# EAGLE design ATEM-Tally-SDI (EAGLE 7.7.0)
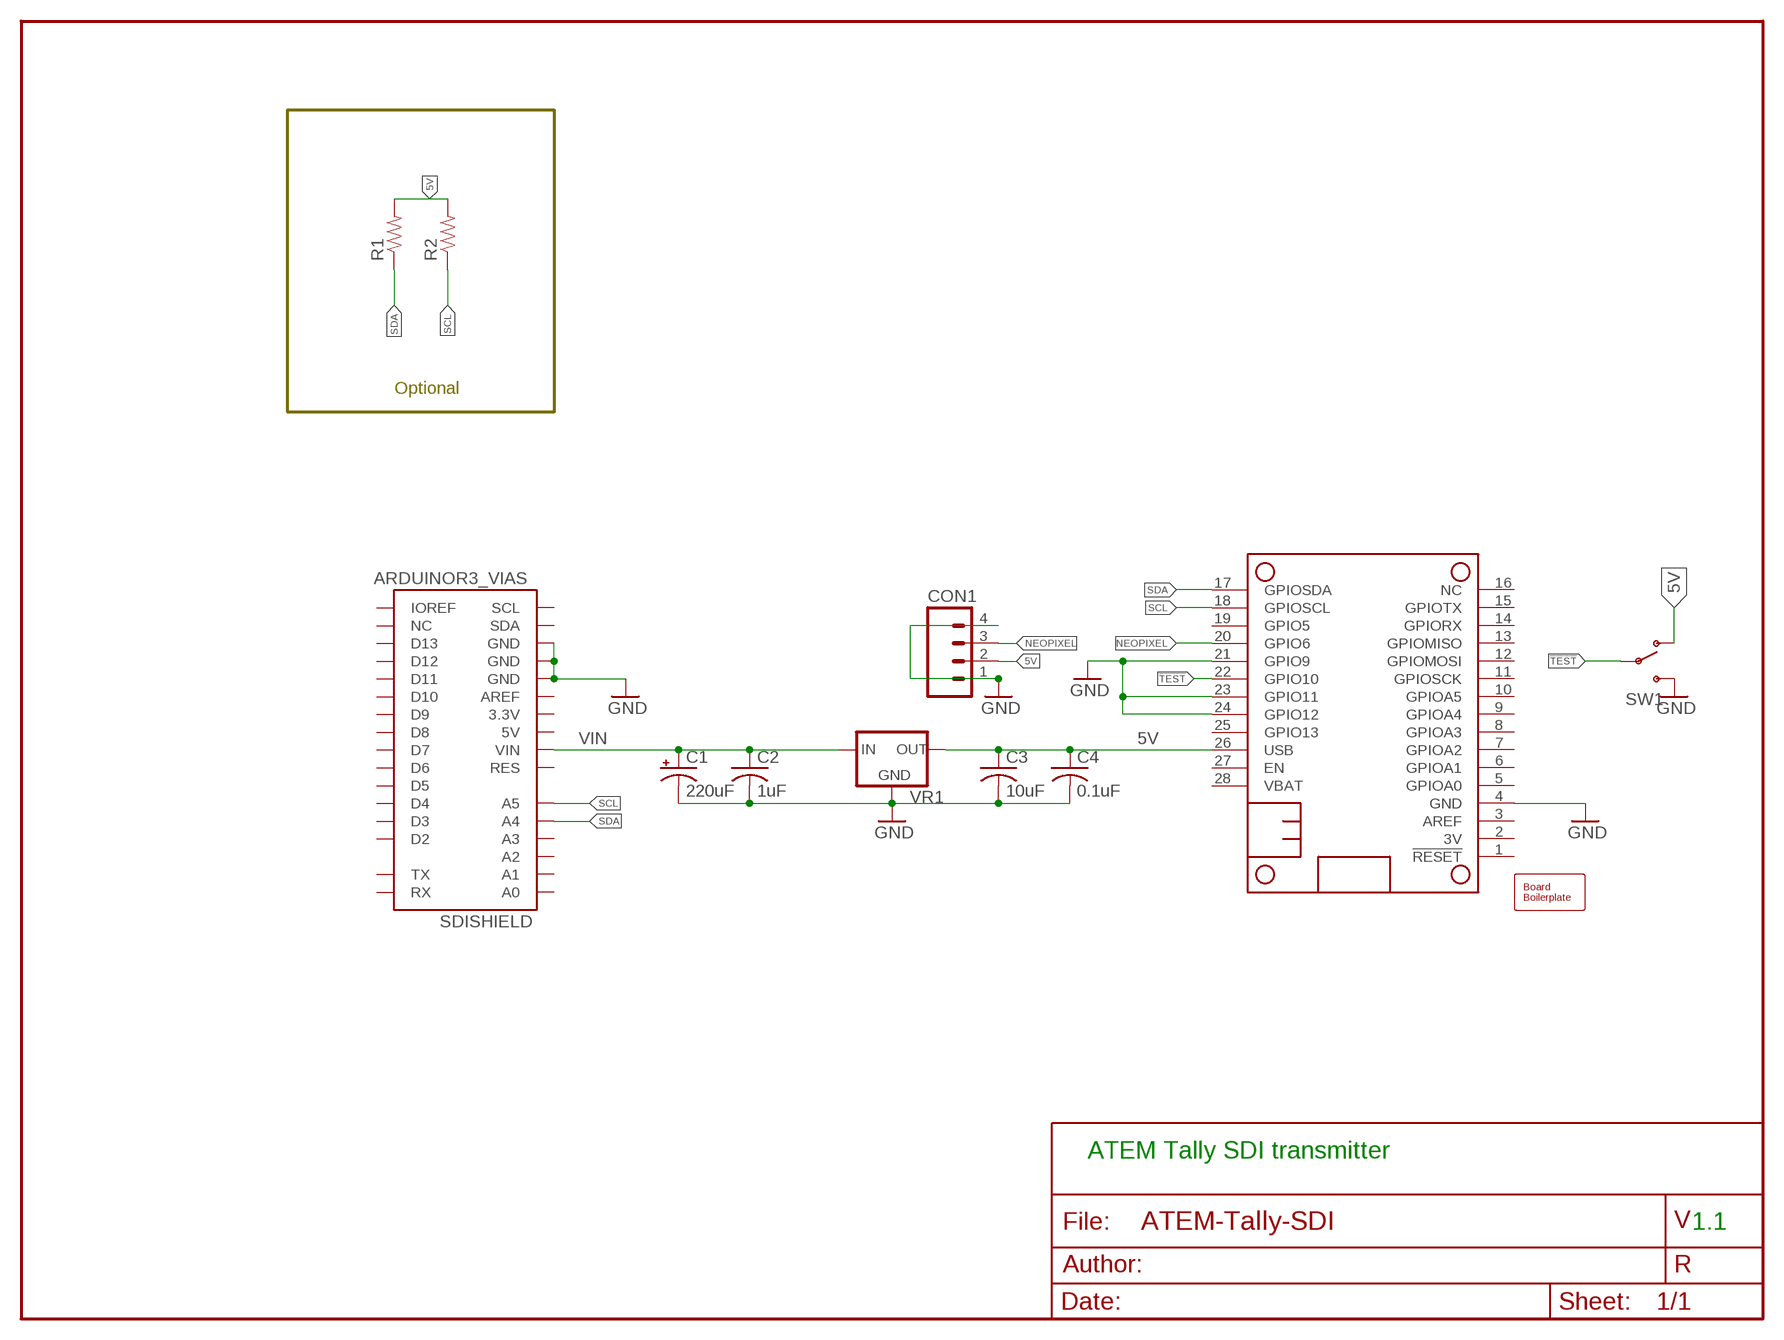
[diagram p0: schematic, sheet 1]

## Parts
BOARD1  BOARD80X100  [BOARD-DINRAIL-3.17INX10CM]
C1  220uF  CAP-POL0810  [0810-CAP]
C2  1uF  CAP0603  [0603-CAP]
C3  10uF  CAP0603  [0603-CAP]
C4  0.1uF  CAP0603  [0603-CAP]
CON1  CONNECTOR-M04LOCK  [1X04_LOCK]
FEATHER  FEATHERWING_NODIM  [FEATHERWING_DIM]
R1  RPTH04  [AXIAL-0.4-RES]
R2  RPTH04  [AXIAL-0.4-RES]
SDISHIELD  ARDUINOR3_VIAS  [ARDUINO_R3_VIAS]
SW1  SWITCH-SPSTPTH  [SWITCH-SPDT]
VR1  VREG-DPAK-5  [TO-252]

## Nets
5V: C3.1 C4.1 CON1.2 FEATHER.26(USB) R1.P$2 R2.P$2 SW1.1(O) VR1.3(OUT)
!TEST: FEATHER.22(GPIO10) SW1.2(P)
GND: C1.- C2.2 C3.2 C4.2 CON1.1 CON1.4 FEATHER.4(GND) FEATHER.21(GPIO9) FEATHER.23(GPIO11) FEATHER.24(GPIO12) SDISHIELD.GND@0(GND) SDISHIELD.GND@1(GND) SDISHIELD.GND@2(GND) SW1.3(S) VR1.2(GND)
NEOPIXEL: CON1.3 FEATHER.20(GPIO6)
SCL: FEATHER.18(GPIOSCL) R2.P$1 SDISHIELD.A5
SDA: FEATHER.17(GPIOSDA) R1.P$1 SDISHIELD.A4
VIN: C1.+ C2.1 SDISHIELD.VIN VR1.1(IN)
Unconnected: FEATHER.1(!RESET) FEATHER.2(3V) FEATHER.3(AREF) FEATHER.5(GPIOA0) FEATHER.6(GPIOA1) FEATHER.7(GPIOA2) FEATHER.8(GPIOA3) FEATHER.9(GPIOA4) FEATHER.10(GPIOA5) FEATHER.11(GPIOSCK) FEATHER.12(GPIOMOSI) FEATHER.13(GPIOMISO) FEATHER.14(GPIORX) FEATHER.15(GPIOTX) FEATHER.16(NC) FEATHER.19(GPIO5) FEATHER.25(GPIO13) FEATHER.27(EN) FEATHER.28(VBAT) SDISHIELD.3.3V SDISHIELD.5V SDISHIELD.A0 SDISHIELD.A1 SDISHIELD.A2 SDISHIELD.A3 SDISHIELD.AREF SDISHIELD.D2 SDISHIELD.D3 SDISHIELD.D4 SDISHIELD.D5 SDISHIELD.D6 SDISHIELD.D7 SDISHIELD.D8 SDISHIELD.D9 SDISHIELD.D10 SDISHIELD.D11 SDISHIELD.D12 SDISHIELD.D13 SDISHIELD.IOREF SDISHIELD.NC1(NC) SDISHIELD.RES SDISHIELD.RX SDISHIELD.SCL SDISHIELD.SDA SDISHIELD.TX

## Notes on the sheet
- Optional
- ATEM Tally SDI transmitter
- 1.1

## Library data of the parts
BOARD1 = SPCoast:BOARD
C1 = SPCoast:CAP-POL*
C2-C4 = SPCoast:CAP*
CON1 = SPCoast:CONNECTOR-M04: Header 4 Standard 4-pin 0.1" header. Use with straight break away headers (SKU : PRT-00116), right angle break away headers (PRT-00553), swiss pins (PRT-00743), machine pins (PRT-00117), and female headers (PRT-00115). Molex polarized connector foot print use with SKU : PRT-08231 with associated crimp pins and housings. 1MM SMD Version SKU: PRT-10208
FEATHER = adafruit:FEATHERWING
R1 R2 = SPCoast:R*: Resistor Basic schematic elements and footprints for 0603, 1206, and PTH 1/10th watt (small) resistors.
SDISHIELD = SPCoast:ARDUINO
SW1 = SPCoast:SWITCH-SPST: SPST Switch Simple slide switch. Spark Fun Electronics SKU : COM-00102
VR1 = SPCoast:VREG-?-*: Voltage Regulator Standard linear regulator. 7805 uses IGO pinout LM1117 uses GOI pinout

## Board
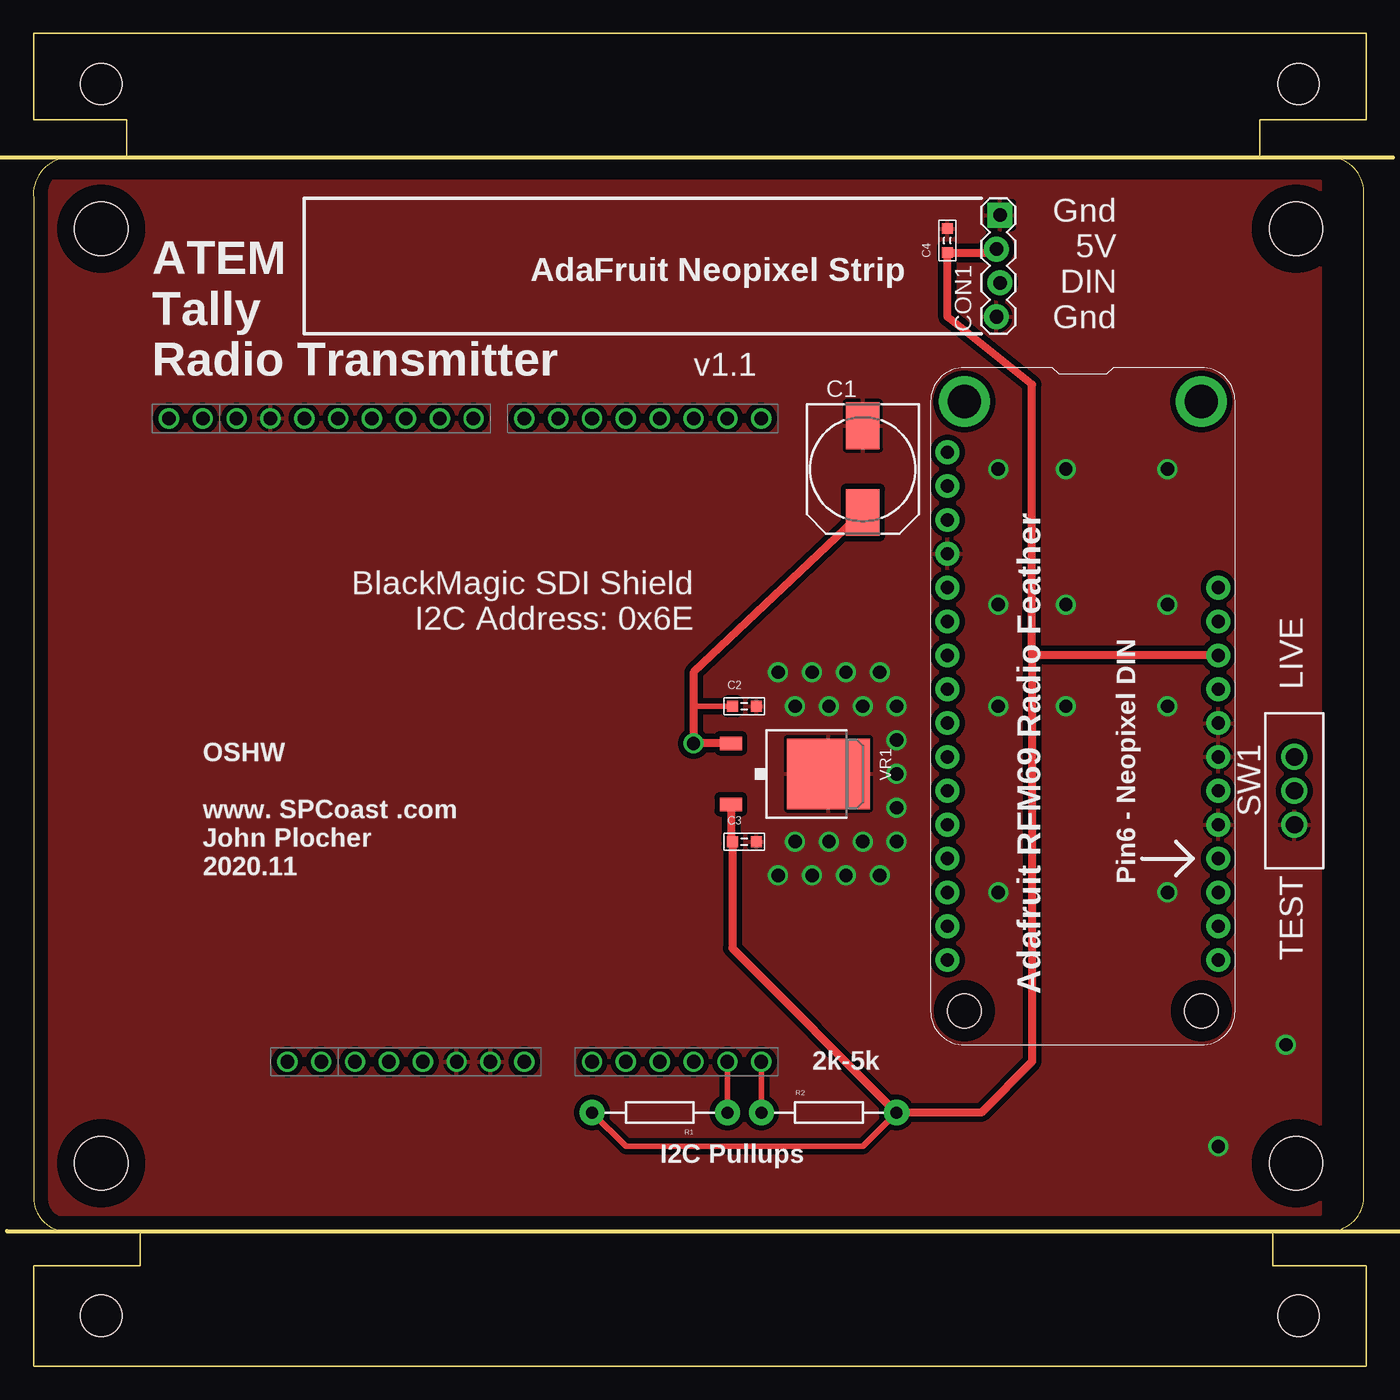
[diagram p1: board, top side]
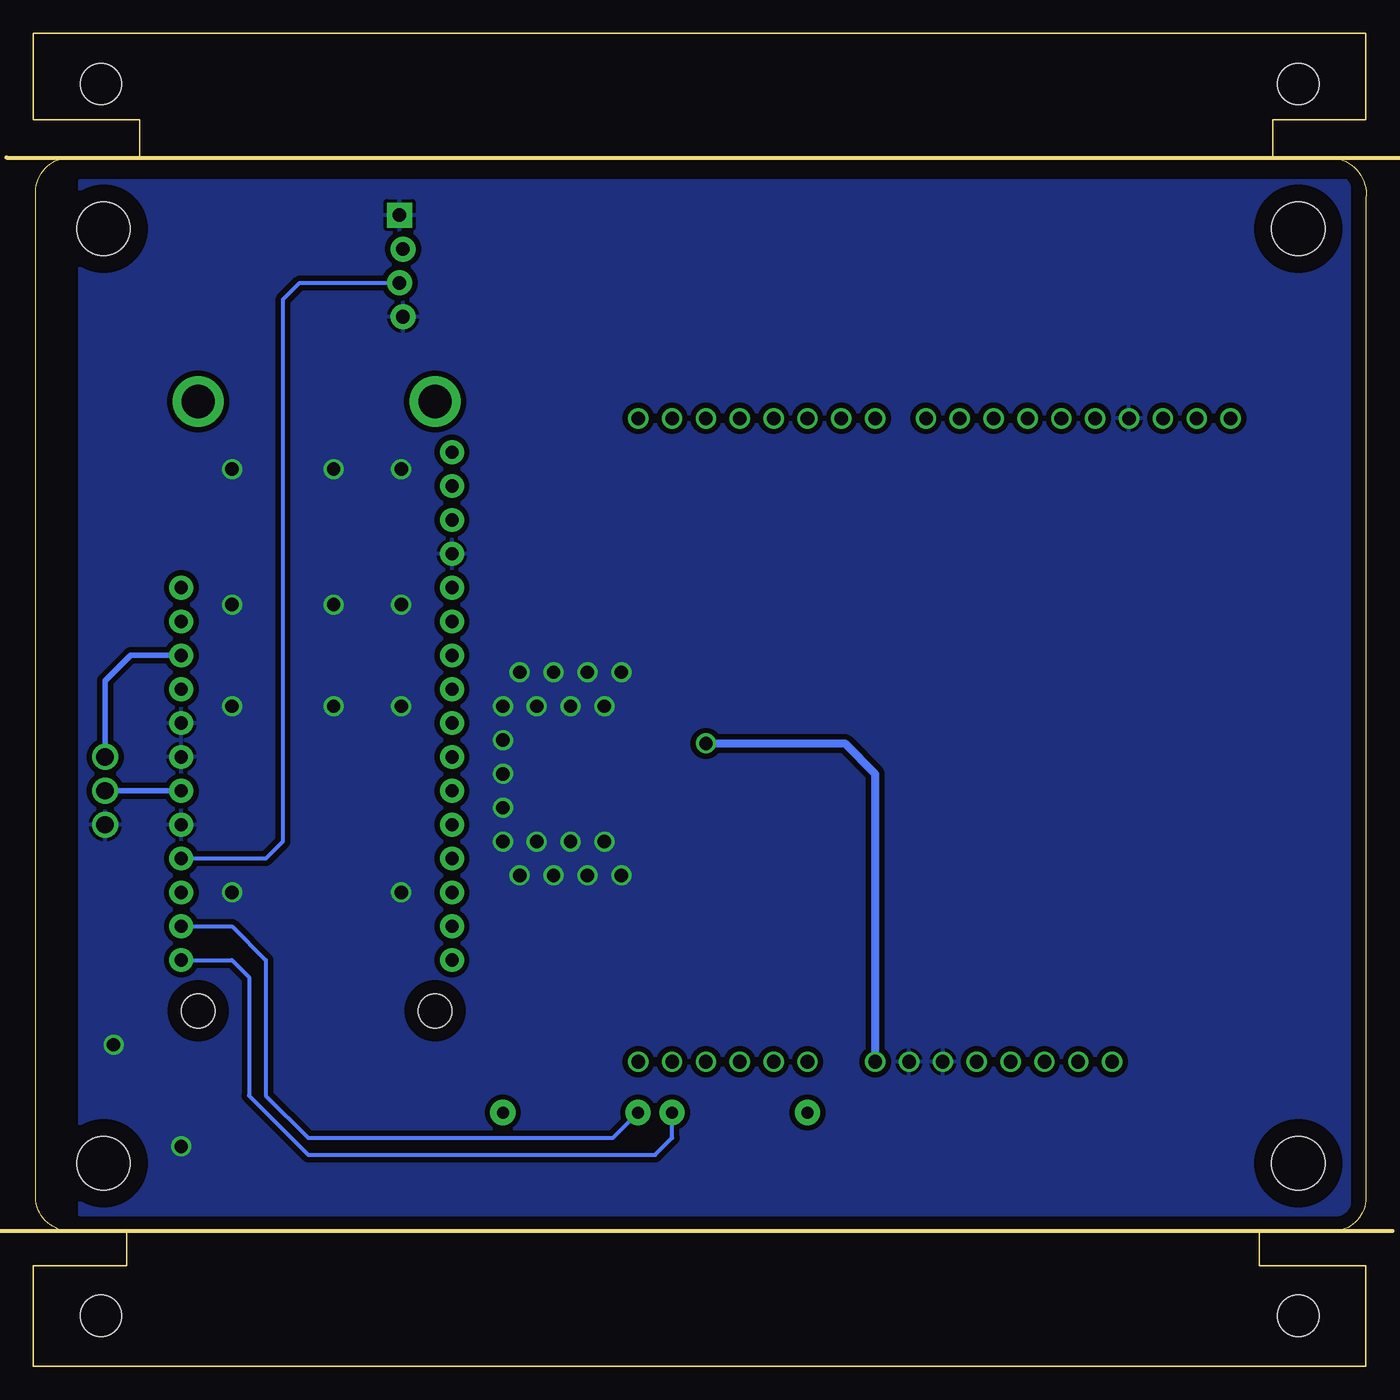
[diagram p2: board, bottom side, seen from below]

Size 100.01 x 100 mm. Coordinates in mm from the lower left corner, seen from the top.
Copper layers (1*16): Top 0.035mm / dielectric 1.5mm / Bottom 0.035mm
Design rules "default": minimum track width 10mil, minimum drill 24mil, track to track 8mil, track to pad 8mil, pad to pad 8mil, via to via 8mil, smd to smd 8mil, copper to edge 40mil, drill to drill 8mil, minimum pad ring 10mil, minimum via ring 8mil, stop-mask expansion 4mil, vias tented up to drill 0mil, thermal gap 10mil

### Footprints (pad centres in the part's own frame; a part is rotated, then mirrored left to right if it is on the bottom)
BOARD-DINRAIL-3.17INX10CM = hole 4: 94.742,15.24; 5.08,85.344; 94.742,85.344; 5.08,15.24 | hole 3.1: 5.08,96.19; 94.92,96.19; 5.08,3.81; 94.92,3.81
0810-CAP = smd 3.5 x 2.5: + 3.25,0; - -3.25,0
0603-CAP = smd 0.813 x 0.813: 1 -0.9,0; 2 0.9,0
1X04_LOCK = drill 1.016 pad 1.88 square: 1 0,0.127 | drill 1.016 pad 1.88: 2 2.54,-0.127; 3 5.08,0.127; 4 7.62,-0.127
FEATHERWING_DIM = drill 1 pad 1.778: 1 6.35,1.27; 2 8.89,1.27; 3 11.43,1.27; 4 13.97,1.27; 5 16.51,1.27; 6 19.05,1.27; 7 21.59,1.27; 8 24.13,1.27; 9 26.67,1.27; 10 29.21,1.27; 11 31.75,1.27; 12 34.29,1.27; 13 36.83,1.27; 14 39.37,1.27; 15 41.91,1.27; 16 44.45,1.27; 17 44.45,21.59; 18 41.91,21.59; 19 39.37,21.59; 20 36.83,21.59; 21 34.29,21.59; 22 31.75,21.59; 23 29.21,21.59; 24 26.67,21.59; 25 24.13,21.59; 26 21.59,21.59; 27 19.05,21.59; 28 16.51,21.59 | drill 2.5 pad 3.81: P$1 2.54,20.32; P$2 2.54,2.54 | hole 2.54: 48.26,20.32; 48.26,2.54
AXIAL-0.4-RES = drill 0.9 pad 1.88: P$1 -5.08,0; P$2 5.08,0
ARDUINO_R3_VIAS = drill 1.016: 3.3V 49.53,17.78; 5V 49.53,20.32; A0 49.53,33.02; A1 49.53,35.56; A2 49.53,38.1; A3 49.53,40.64; A4 49.53,43.18; A5 49.53,45.72; AREF 1.27,6.35; D2 1.27,40.64; D3 1.27,38.1; D4 1.27,35.56; D5 1.27,33.02; D6 1.27,30.48; D7 1.27,27.94; D8 1.27,24.13; D9 1.27,21.59; D10 1.27,19.05; D11 1.27,16.51; D12 1.27,13.97; D13 1.27,11.43; GND@0 49.53,22.86; GND@1 49.53,25.4; GND@2 1.27,8.89; IOREF 49.53,12.7; NC1 49.53,10.16; RES 49.53,15.24; RX 1.27,45.72; SCL 1.27,1.27; SDA 1.27,3.81; TX 1.27,43.18; VIN 49.53,27.94
SWITCH-SPDT = drill 1.3: 1 0,2.54; 2 0,0; 3 0,-2.54
TO-252 = smd 1.651 x 1.016: 1 -4.826,2.286; 3 -4.826,-2.286 | smd 6.2 x 5.3: 2 2.5,0

### Placement (x,y rotation side)
BOARD1  0.01,0 0 top
C1  62.24,67.31 270 top
C2  53.35,49.53 0 top
C3  53.35,39.37 0 top
C4  68.59,84.45 90 top
CON1  72.4,86.36 270 top
FEATHER  67.32,74.93 270 top
R1  47,19.05 180 top
R2  59.7,19.05 0 top
SDISHIELD  8.9,72.39 270 top
SW1  94.63,43.18 0 top
VR1  57.16,44.45 0 top

### Tracks (layer width: path | path; a pad name or v marks a point on that pad's centre or on a via)
5V
  Top 0.305: 72.01,83.56 CON1.2
  Top 0.406: R1.P$2 44.46,16.51 62.24,16.51 R2.P$2
  Top 0.61: VR1.3 52.34,39.49 C3.1 52.45,31.38 R2.P$2 71.13,19.05 74.94,22.86 74.94,53.34 | FEATHER.26 74.94,53.34 | 72.01,83.56 C4.1 68.59,78.74 74.94,73.66 74.94,53.34
  Bottom 0.406: SW1.1 94.63,51.44 92.72,53.34 FEATHER.26
!TEST
  Bottom 0.406: SW1.2 FEATHER.22
GND  (via drill 1)
  other vias: 57.16,49.53 59.7,49.53 62.24,49.53 64.78,49.53 57.16,39.37 59.7,39.37 62.24,39.37 64.78,39.37 64.78,41.91 64.78,46.99 64.78,44.45 55.89,36.83 58.43,36.83 60.97,36.83 63.51,36.83 63.51,52.07 60.97,52.07 58.43,52.07 55.89,52.07 85.1,49.53 85.1,35.56 85.1,57.15 85.1,67.31 77.48,57.15 77.48,67.31 77.48,49.53 93.99,24.13 88.91,16.51 72.4,67.31 72.4,57.15 72.4,49.53 72.4,35.56
  pour Top (isolate 0.406): 1.28,88.9 96.53,88.9 96.53,11.43 1.28,11.43
  pour Bottom (isolate 0.406): 1.28,88.9 96.53,88.9 96.53,11.43 1.28,11.43
NEOPIXEL
  Bottom 0.305: FEATHER.20 82.56,38.1 81.29,39.37 81.29,80.01 80.02,81.28 CON1.3
SCL
  Top 0.406: R2.P$1 SDISHIELD.A5
  Bottom 0.305: FEATHER.18 85.1,33.02 82.56,30.48 82.56,20.32 79.39,17.14 56.53,17.14 R2.P$1
SDA
  Top 0.406: R1.P$1 SDISHIELD.A4
  Bottom 0.305: FEATHER.17 85.1,30.48 83.83,29.21 83.83,20.32 79.39,15.88 53.35,15.88 52.08,17.14 R1.P$1
VIN  (via drill 1)
  Top 0.406: C2.1 49.54,49.53
  Top 0.61: VR1.1 v49.54,46.74 49.54,49.53 49.54,52.07 C1.+
  Bottom 0.61: v49.54,46.74 39.13,46.74 36.84,44.45 SDISHIELD.VIN

### Text on the board
tPlace: Gnd / 5V / DIN / Gnd | AdaFruit Neopixel Strip | ATEM / Tally / Radio Transmitter | v1.1 | BlackMagic SDI Shield / I2C Address: 0x6E | Pin6 - Neopixel DIN | LIVE | OSHW / / www. SPCoast .com / John Plocher / 2020.11 | TEST | Adafruit RFM69 Radio Feather | 2k-5k | I2C Pullups